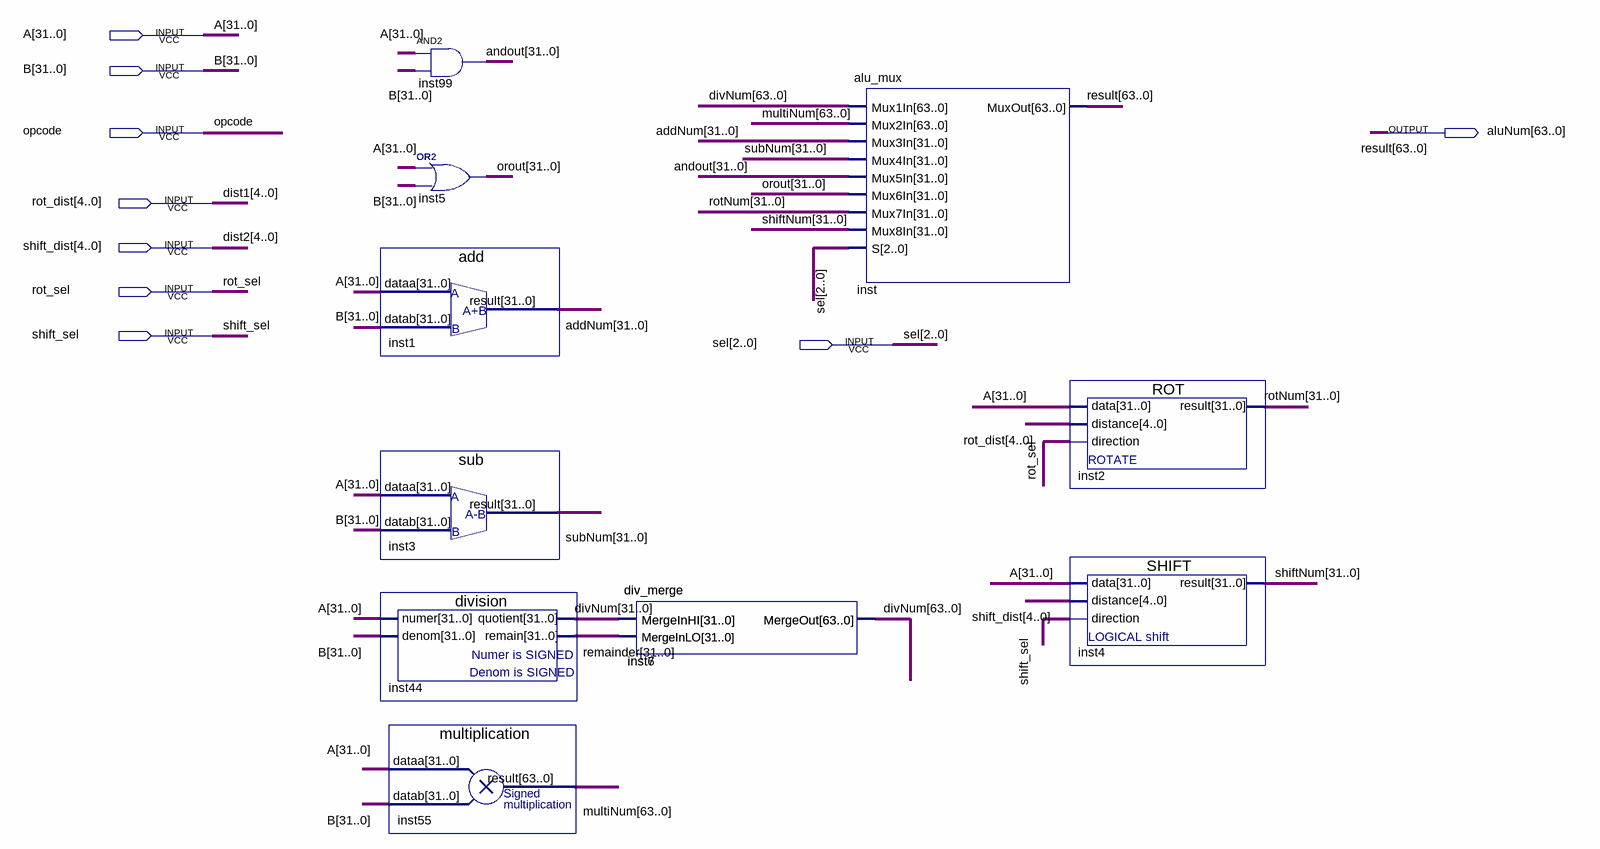
[diagram p0: schematic sheet]
// Quartus schematic ALU.bdf as structural Verilog: 11 symbols, 9 pins
module ALU (
  input  [31:0] A,
  input  [31:0] B,
  input  opcode,
  input  [4:0] rot_dist,
  input  [4:0] shift_dist,
  input  rot_sel,
  input  shift_sel,
  input  [2:0] sel,
  output [63:0] aluNum
);

  wire [31:0] addNum, andout, orout, remainder, rotNum, shiftNum, subNum;
  wire [63:0] divNum, multiNum;

  assign andout = A & B;  // AND2 inst99, 32 bits wide
  assign orout = A | B;  // OR2 inst5, 32 bits wide
  add inst1 (.dataa(A), .datab(B), .result(addNum));
  sub inst3 (.dataa(A), .datab(B), .result(subNum));
  division inst44 (.numer(A), .denom(B), .quotient(divNum[31:0]), .remain(remainder));
  multiplication inst55 (.dataa(A), .datab(B), .result(multiNum));
  div_merge inst6 (.MergeInHI(divNum[31:0]), .MergeInLO(remainder), .MergeOut(divNum));
  div_merge inst7 (.MergeInHI(divNum[31:0]), .MergeInLO(remainder), .MergeOut(divNum));
  alu_mux inst (
    .Mux1In(divNum), .Mux2In(multiNum), .Mux3In(addNum), .Mux4In(subNum), .Mux5In(andout), .Mux6In(orout),
    .Mux7In(rotNum), .Mux8In(shiftNum), .S(sel), .MuxOut(aluNum));
  ROT inst2 (.data(A), .distance(rot_dist), .direction(rot_sel), .result(rotNum));
  SHIFT inst4 (.data(A), .distance(shift_dist), .direction(shift_sel), .result(shiftNum));

  // Other names for the same wires on the sheet: dist1[4:0] = rot_dist; dist2[4:0] = shift_dist;
  //   result[63:0] = aluNum
endmodule
